# Altium schematic sheet PowerAmplifier_Front.SchDoc
size A4
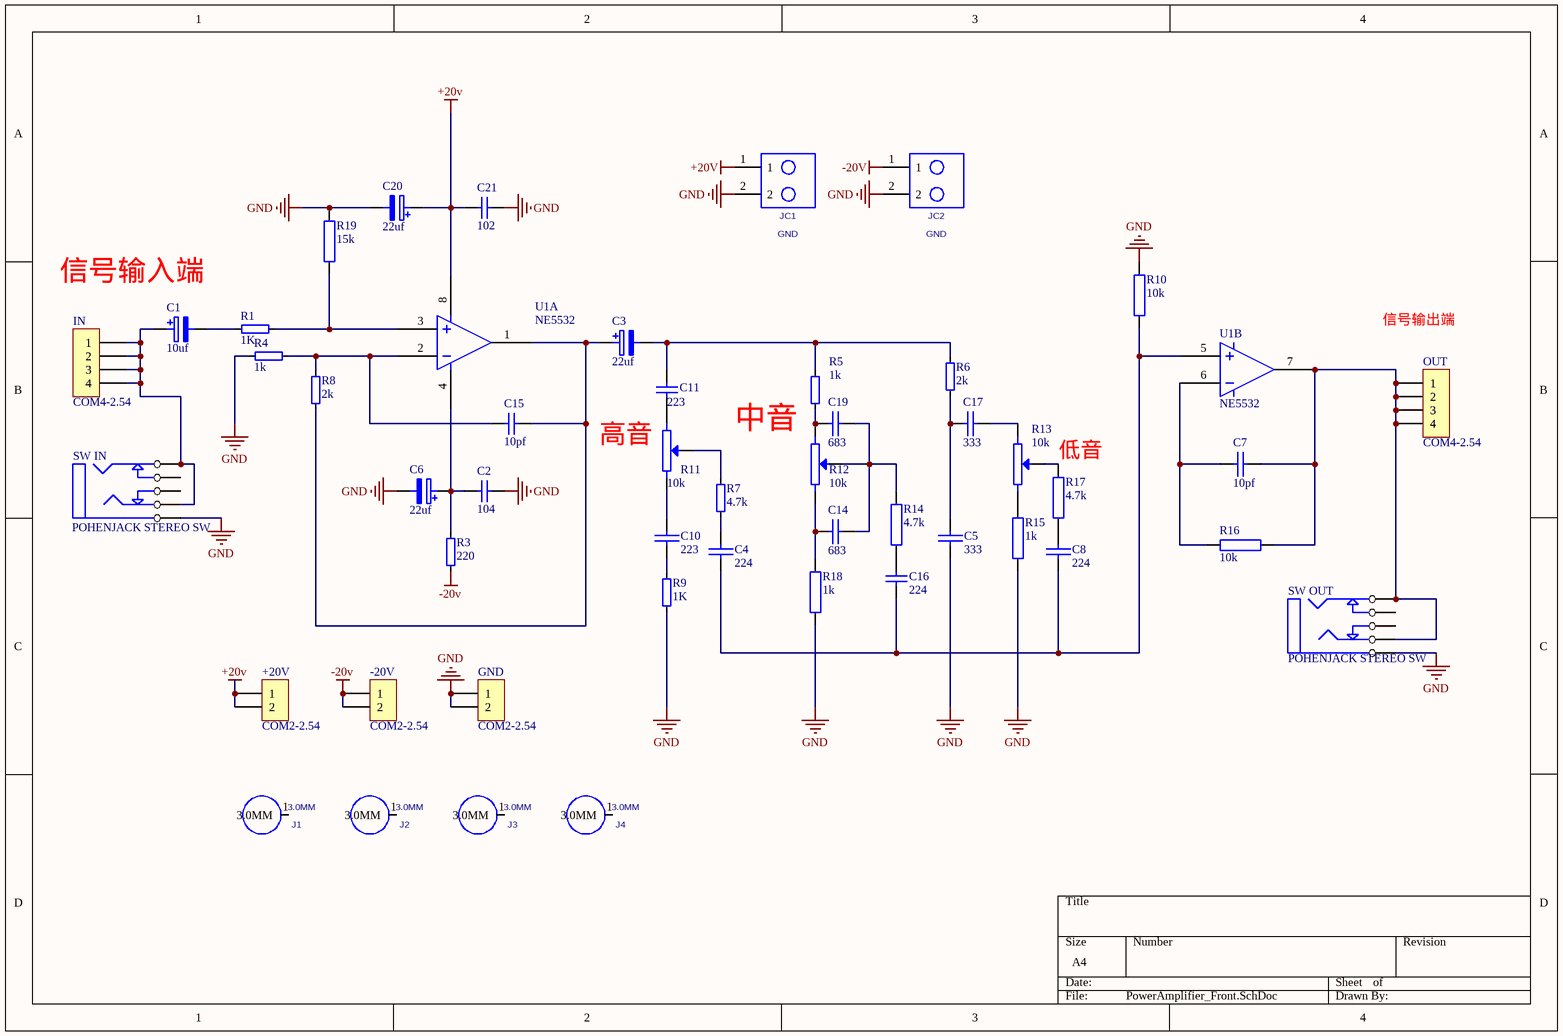
[diagram p0: PowerAmplifier_Front.SchDoc]

## Parts
+20V  COM2-2.54  [COM2-2.54]
-20V  COM2-2.54  [COM2-2.54]
C1  10uf  [RB.1/.2]
C2  value 104  [CAPR2.54-5.1x3.2]  (hidden comment: Cap)
C3  22uf  [RB.1/.2]
C4  224  [RAD0.15]
C5  333  [RAD0.15]
C6  22uf  [RB.1/.2]
C7  10pf  [RAD0.15]
C8  224  [RAD0.15]
C10  223  [RAD0.15]
C11  value 223  [CAPR2.54-5.1x3.2]  (hidden comment: Cap)
C14  683  [RAD0.15]
C15  value 10pf  [CAPR2.54-5.1x3.2]  (hidden comment: Cap)
C16  value 224  [CAPR2.54-5.1x3.2]  (hidden comment: Cap)
C17  333  [RAD0.15]
C19  683  [RAD0.15]
C20  22uf  [RB.08/.12]
C21  value 102  [CAPR2.54-5.1x3.2]  (hidden comment: Cap)
GND  COM2-2.54  [COM2-2.54]
IN  COM4-2.54  [COM4-2.54]
J1  3.0MM  [3.0MM]
J2  3.0MM  [3.0MM]
J3  3.0MM  [3.0MM]
J4  3.0MM  [3.0MM]
JC1  GND  [CON_2PIN]
JC2  GND  [CON_2PIN]
OUT  COM4-2.54  [COM4-2.54]
R1  1K  [AXIAL0.5]
R3  220  [AXIAL0.5]
R4  1k  [AXIAL0.5]
R5  1k  [AXIAL0.5]
R6  2k  [AXIAL0.5]
R7  4.7k  [AXIAL0.5]
R8  2k  [AXIAL0.5]
R9  1K  [AXIAL0.5]
R10  10k  [AXIL0.5]
R11  10k  [wh148-1-g15]
R12  10k  [wh148-1-g15]
R13  10k  [wh148-1-g15]
R14  4.7k  [AXIL0.5]
R15  1k  [AXIL0.5]
R16  10k  [AXIL0.5]
R17  4.7k  [AXIL0.5]
R18  1k  [AXIL0.5]
R19  15k  [AXIL0.4]
SW_IN  POHENJACK STEREO SW  [POHENJACK STEREO SW]
SW_OUT  POHENJACK STEREO SW  [POHENJACK STEREO SW]
U1  NE5532  [NE5532]  (parts A,B of 2)

## Nets
+20v: +20V.1 +20V.2 C20.1 C21.2 JC1.1 U1.8
-20v: -20V.1 -20V.2 JC2.1 R3.1
GND: C2.1 C5.2 C6.2 C20.2 C21.1 GND.1 GND.2 JC1.2 JC2.2 R4.2 R9.2 R10.2 R15.1 R18.1 R19.2 SW_IN.5(E) SW_OUT.5(E)
NetC1_1: C1.1 IN.1 IN.2 IN.3 IN.4 SW_IN.1(A) SW_IN.4(D)
NetC1_2: C1.2 R1.1
NetC2_2: C2.2 C6.1 R3.2 U1.4
NetC3_1: C3.1 C15.1 R8.2 U1.1
NetC3_2: C3.2 C11.1 R5.1 R6.1
NetC4_1: C4.1 R7.2
NetC4_2: C4.2 C8.2 C16.1 R10.1 U1.5
NetC5_1: C5.1 C17.1 R6.2
NetC7_1: C7.1 R16.1 U1.6
NetC7_2: C7.2 OUT.1 OUT.2 OUT.3 OUT.4 R16.2 SW_OUT.1(A) SW_OUT.4(D) U1.7
NetC8_1: C8.1 R17.1
NetC10_1: C10.1 R11.3
NetC10_2: C10.2 R9.1
NetC11_2: C11.2 R11.1
NetC14_1: C14.1 C19.2 R12.2(W) R14.2
NetC14_2: C14.2 R12.3 R18.2
NetC15_2: C15.2 R4.1 R8.1 U1.2
NetC16_2: C16.2 R14.1
NetC17_2: C17.2 R13.1
NetC19_1: C19.1 R5.2 R12.1
NetR1_2: R1.2 R19.1 U1.3
NetR7_1: R7.1 R11.2(W)
NetR13_2: R13.2(W) R17.2
NetR13_3: R13.3 R15.2

Not connected (* = marked no-connect by the designer): J1 1(3.0MM); J2 1(3.0MM); J3 1(3.0MM); J4 1(3.0MM); SW_IN 2(B) 3(C); SW_OUT 2(B) 3(C)

## Notes on the sheet
- 信号输入端
- 信号输出端
- 高音
- 中音
- (near R17) 低音

## Library data of the parts
C1 C3 C6 C20 = CAP_E: Electrolytic Capacitor
C2 C11 C15 C16 C21 = Cap: Capacitor; Published: 8-Jun-2000; LatestRevisionDate: 17-Jul-2002; LatestRevisionNote: Re-released for DXP Platform.; Publisher: Altium Limited
C4 C5 C7 C8 C10 C14 C17 C19 = CAP1
JC1 JC2 = CON_2PIN: PCB DECAL: CON_2PIN
R1 R3-R9 = RES
R10 R14-R19 = 电阻
R11-R13 = 滑动变阻器
J1-J4 = 3.0MM: PCB DECAL: 3.0MM